# Altium schematic sheet Synchronizer.SchDoc
size A4; DocumentNumber: 5; SheetNumber: 5; SheetTotal: 5
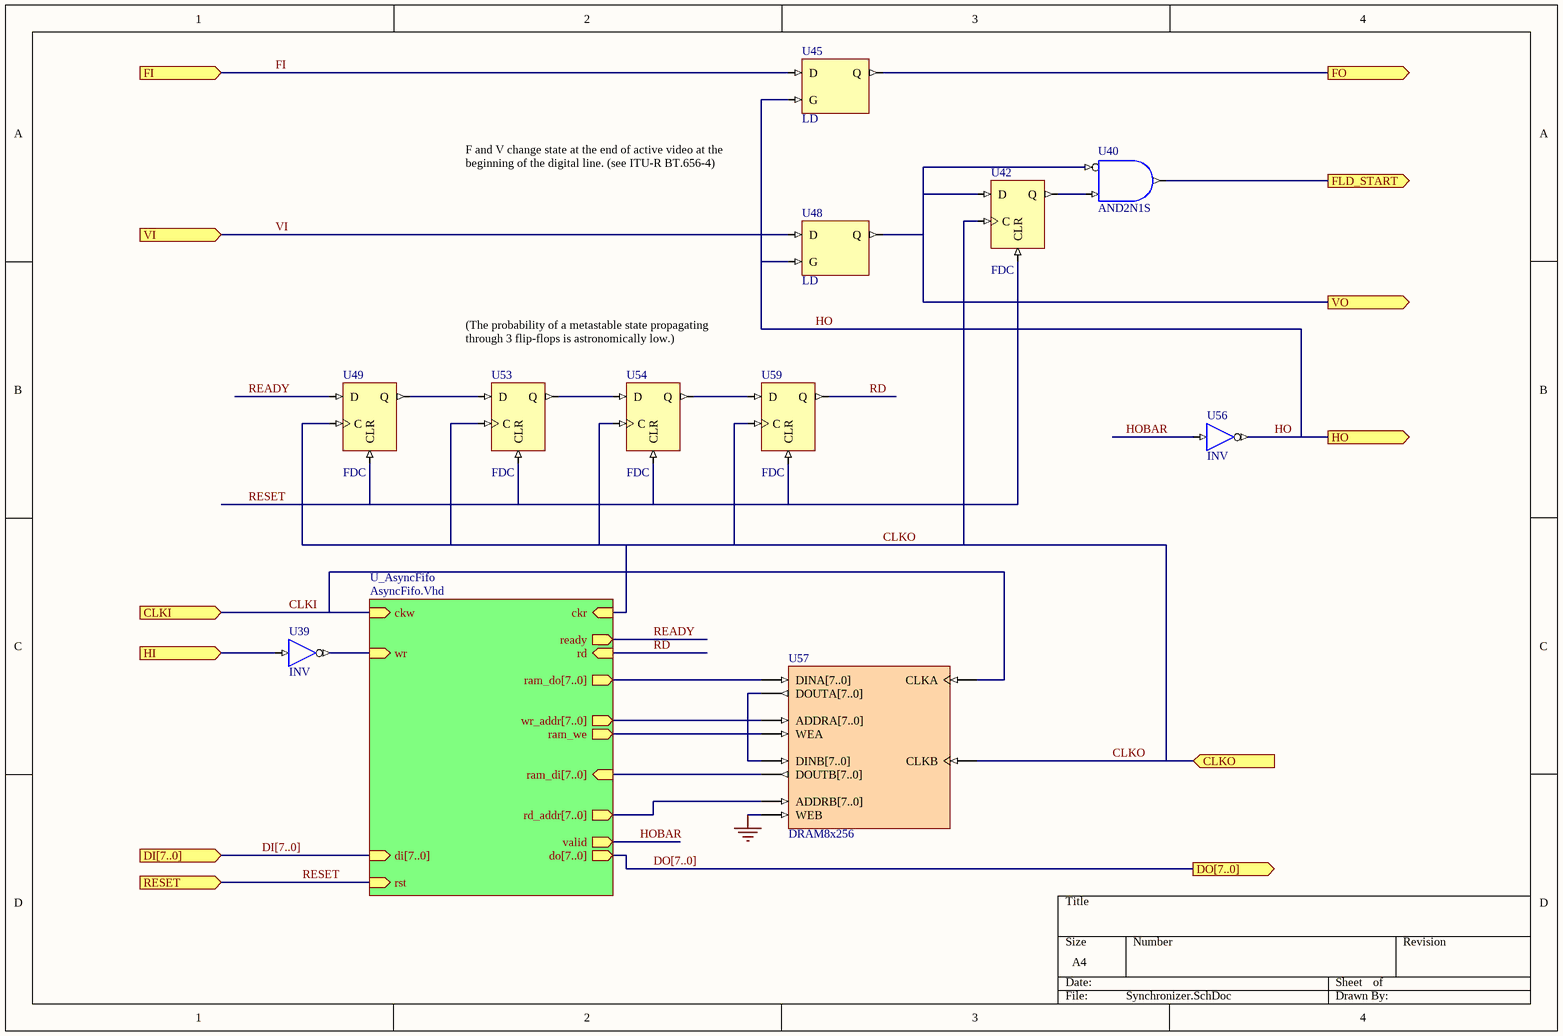
[diagram p0: Synchronizer.SchDoc]

## Parts
U39  INV
U40  AND2N1S
U42  FDC
U45  LD
U48  LD
U49  FDC
U53  FDC
U54  FDC
U56  INV
U57  DRAM8x256
U59  FDC

## Sub-sheets
U_AsyncFifo = AsyncFifo.Vhd: ckr (in), ckw (in), di[7..0] (in), do[7..0] (out), ram_di[7..0] (in), ram_do[7..0] (out), ram_we (out), rd (in), rd_addr[7..0] (out), ready (out), rst (in), valid (out), wr (in), wr_addr[7..0] (out)  | VHDLENTITY: AsyncFifo

## Ports
CLKI (in), CLKO (in), DI[7..0] (in), DO[7..0] (out), FI (in), FLD_START (out), FO (out), HI (in), HO (out), RESET (in), VI (in), VO (out)

## Nets
GND: U57.WEB
CLKI: U57.CLKA ; port CLKI, sheet U_AsyncFifo/ckw
CLKO: U42.C U49.C U53.C U54.C U57.CLKB U59.C ; port CLKO, sheet U_AsyncFifo/ckr
FI: U45.D ; port FI
FLD_START: U40.O ; port FLD_START
FO: U45.Q ; port FO
HI: U39.I ; port HI
HO: U45.G U48.G U56.O ; port HO
HOBAR: U56.I ; sheet U_AsyncFifo/valid
RD: U59.Q ; sheet U_AsyncFifo/rd
READY: U49.D ; sheet U_AsyncFifo/ready
RESET: U42.CLR U49.CLR U53.CLR U54.CLR U59.CLR ; port RESET, sheet U_AsyncFifo/rst
VI: U48.D ; port VI
VO: U40.I0 U42.D U48.Q ; port VO
NetU39_O: U39.O ; sheet U_AsyncFifo/wr
NetU40_I1: U40.I1 U42.Q
NetU49_Q: U49.Q U53.D
NetU53_Q: U53.Q U54.D
NetU54_Q: U54.Q U59.D
NetU57_ADDRA[7..0]: U57.ADDRA[7..0] ; sheet U_AsyncFifo/wr_addr[7..0]
NetU57_ADDRB[7..0]: U57.ADDRB[7..0] ; sheet U_AsyncFifo/rd_addr[7..0]
NetU57_DINA[7..0]: U57.DINA[7..0] ; sheet U_AsyncFifo/ram_do[7..0]
NetU57_DINB[7..0]: U57.DINB[7..0] U57.DOUTA[7..0]
NetU57_DOUTB[7..0]: U57.DOUTB[7..0] ; sheet U_AsyncFifo/ram_di[7..0]
NetU57_WEA: U57.WEA ; sheet U_AsyncFifo/ram_we

## Buses and harness runs
bus DI[7..0] = port DI[7..0] = sheet U_AsyncFifo/di[7..0]
bus DO[7..0] = port DO[7..0] = sheet U_AsyncFifo/do[7..0]

## Notes on the sheet
- F and V change state at the end of active video at the beginning of the digital line. (see ITU-R BT.656-4)
- (The probability of a metastable state propagating through 3 flip-flops is astronomically low.)

## Library data of the parts
U39 U56 = INV: Inverter; ArchiveName: GENERIC; Published: 18-Nov-2003; Publisher: Altium Limited; Xilinx Equivalent: INV; Core Revision: 1.00.00
U40 = AND2N1S: 2-Input AND Gate with Active Low A Input, Single Pin Version; Xilinx Equivalent: AND2B1; ArchiveName: GENERIC; Published: 18-Nov-2003; Publisher: Altium Limited; Core Revision: 1.00.00
U42 U49 U53 U54 U59 = FDC: D-Type Flip-Flop with Asynchronous Clear; ArchiveName: GENERIC; Published: 18-Nov-2003; Publisher: Altium Limited; Xilinx Equivalent: FDC; Core Revision: 1.00.00
U45 U48 = LD: Transparent Data Latch; ArchiveName: GENERIC; Published: 18-Nov-2003; Publisher: Altium Limited; Xilinx Equivalent: LD; Core Revision: 1.00.00
U57 = DRAM8x256: Dual Port Random Access Memory 256 x 8 and 256 x 8; Memory_DepthA: 256; Memory_Type: RAM_DualPortBlock; Memory_WidthA: 8; Memory_ClockEdge: Rising; Nexus_Core: Memory_Program; Published: 26/09/2003; Publisher: Altium Hobart Technology Center; Memory_DepthB: 256; Memory_WidthB: 8